# Altium project BK5811FEM.PrjPcb
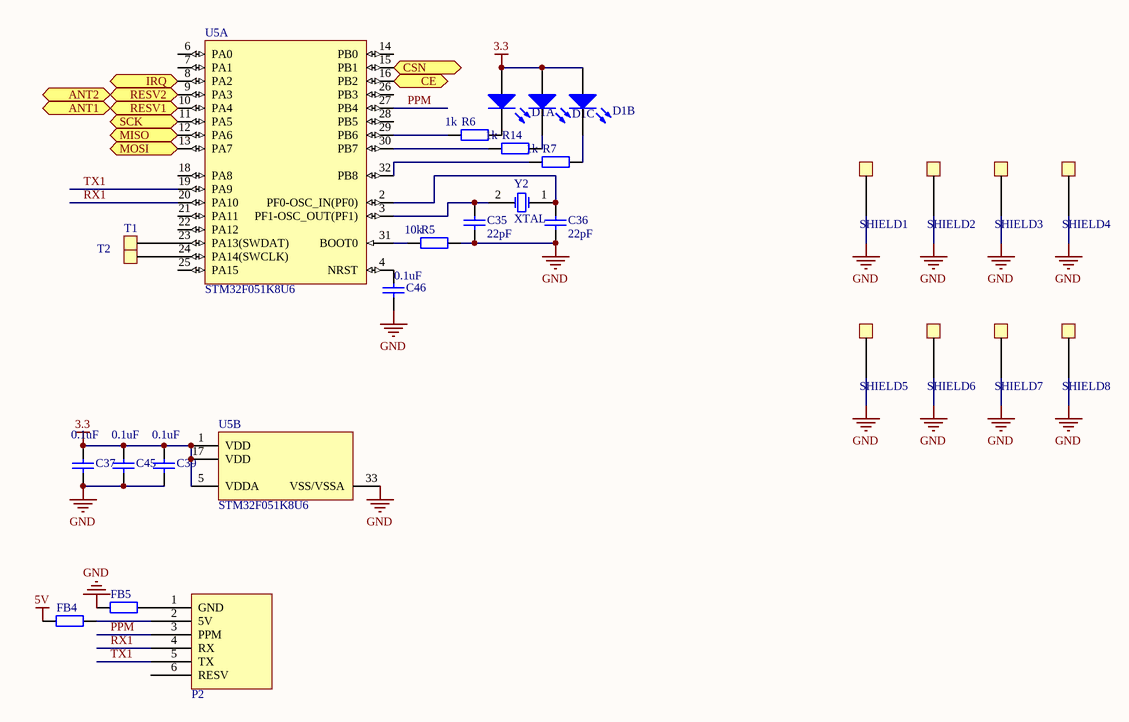
[diagram p0: MCU.SchDoc]
3 sheets, 97 parts. Net scope: flat (ports and power ports of the same name join across sheets).
Board file: 5811FEM.PcbDoc
Sheets:
  MCU.SchDoc
  BK5811.SchDoc
  FEM.SchDoc

## Sheet MCU.SchDoc
size A4

### Parts
C35  22pF  [0402]
C36  22pF  [0402]
C37  0.1uF  [0402]
C39  0.1uF  [0402]
C45  0.1uF  [0402]
C46  0.1uF  [0402]
D1  LEDx3  [LC-0603_Rx2]  (value not drawn)  (parts A,B,C of 3)
FB4  Res2  [0402]  (value not drawn)
FB5  Res2  [0402]  (value not drawn)
P2  PPMInf  [PPMInf]  (value not drawn)
R5  10k  [0402]
R6  1k  [0402]
R7  1k  [0402]
R14  1k  [0402]
SHIELD1  D  [ShieldHolder_6.5*0.8]  (value not drawn)
SHIELD2  D  [ShieldHolder_6.5*0.8]  (value not drawn)
SHIELD3  D  [ShieldHolder_6.5*0.8]  (value not drawn)
SHIELD4  D  [ShieldHolder_6.5*0.8]  (value not drawn)
SHIELD5  D  [ShieldHolder_6.5*0.8]  (value not drawn)
SHIELD6  D  [ShieldHolder_6.5*0.8]  (value not drawn)
SHIELD7  D  [ShieldHolder_6.5*0.8]  (value not drawn)
SHIELD8  D  [ShieldHolder_6.5*0.8]  (value not drawn)
T1  D  [TestPad - 1mm]  (value not drawn)
T2  TestPad  [TestPad - 1mm]  (value not drawn)
U5  STM32F051K8U6  [STM-UFQFPN32_NX]  (parts A,B of 2)
Y2  XTAL  [OSCILLATOR-3.2X2.5 - 2P]

### Ports
ANT1, ANT2, CE, CSN, IRQ, MISO, MOSI, RESV1, RESV2, SCK

### Nets
3.3: C37.1 C39.1 C45.1 D1.2(A) U5.1(VDD) U5.5(VDDA) U5.17(VDD)
5V: FB4.1
GND: C35.2 C36.1 C37.2 C39.2 C45.2 C46.2 FB5.1 R5.2 SHIELD1.1 SHIELD2.1 SHIELD3.1 SHIELD4.1 SHIELD5.1 SHIELD6.1 SHIELD7.1 SHIELD8.1 U5.33(VSS/VSSA)
CE: U5.16(PB2) ; port CE
CSN: U5.15(PB1) ; port CSN
IRQ: U5.8(PA2) ; port IRQ
MISO: U5.12(PA6) ; port MISO
MOSI: U5.13(PA7) ; port MOSI
PPM: P2.3(PPM) U5.27(PB4)
RX1: P2.4(RX) U5.20(PA10)
SCK: U5.11(PA5) ; port SCK
TX1: P2.5(TX) U5.19(PA9)
NetC35_1: C35.1 U5.3(PF1-OSC_OUT(PF1)) Y2.2(OSC2)
NetC36_2: C36.2 U5.2(PF0-OSC_IN(PF0)) Y2.1(OSC1)
NetC38_2: U5.9(PA3) ; port RESV2, port ANT2
NetC44_2: U5.10(PA4) ; port RESV1, port ANT1
NetC46_1: C46.1 U5.4(NRST)
NetD1_1: D1.1(K) R6.2
NetD1_3: D1.3(K) R7.2
NetD1_4: D1.4(K) R14.2
NetFB4_2: FB4.2 P2.2(5V)
NetFB5_2: FB5.2 P2.1(GND)
NetR5_1: R5.1 U5.31(BOOT0)
NetR6_1: R6.1 U5.29(PB6)
NetR7_1: R7.1 U5.32(PB8)
NetR14_1: R14.1 U5.30(PB7)
NetT1_1: T1.1 U5.23(PA13(SWDAT))
NetT2_1: T2.1 U5.24(PA14(SWCLK))

Not connected (* = marked no-connect by the designer): P2 6(RESV); U5 6(PA0) 7(PA1) 14(PB0) 18(PA8) 21(PA11) 22(PA12) 25(PA15) 26(PB3) 28(PB5)

### Library data of the parts
C35-C37 C39 C45 C46 = Cap: Capacitor; Published: 8-Jun-2000; LatestRevisionDate: 17-Jul-2002; LatestRevisionNote: Re-released for DXP Platform.; PackageReference: RAD-0.3; Publisher: Altium Limited; PackageDescription: Radial Cap, Thru-Hole; 2 Leads; 0.3 in Pin Spacing
D1 = LEDx3: Typical RED GaAs LED; Published: 8-Jun-2000; LatestRevisionDate: 08-Jul-2005; LatestRevisionNote: Mech Layer 1 removed.; PackageReference: LED-1; Publisher: Altium Limited; PackageDescription: LED; 2 Leads
FB4 FB5 = Res2: Resistor; Value: FB; Published: 8-Jun-2000; LatestRevisionDate: 17-Jul-2002; LatestRevisionNote: Re-released for DXP Platform.; PackageReference: AXIAL-0.4; Publisher: Altium Limited; PackageDescription: Axial Device, Thru-Hole; 2 Leads; 0.4 in Pin Spacing
R5-R7 R14 = Res2: Resistor; Value: 22k 1%; Published: 8-Jun-2000; LatestRevisionDate: 17-Jul-2002; LatestRevisionNote: Re-released for DXP Platform.; PackageReference: AXIAL-0.4; Publisher: Altium Limited; PackageDescription: Axial Device, Thru-Hole; 2 Leads; 0.4 in Pin Spacing
SHIELD1-SHIELD8 T1 = TestPad
U5 = STM32F051K8U6: ARM Cortex-M0 32-bit MCU, 64 KB Flash, 8 KB Internal RAM, 27 I/Os, 32-pin UFQFPN, -40 to 85 degC, Tray; FLASH Size (Prog) (kB): 64; I/Os (High Current): 27; Internal RAM Size (kB): 8; Operating Frequency(F) (Processor speed) (MHz): 48; Supply Voltage(Vcc) min (V): 2; DatasheetVersion: Rev. 3; PackageVersion: Rev. 3, 07/2012; PackageReference: UFQFPN32; PackageDescription: 32-Pin Ultra Thin Fine Pitch Quad Flat No-Lead, 5 x 5 x 0.6 mm Body, 0.5 mm Pitch, Exposed Pad; Supplier 1: Digi-Key; Supplier Part Number 1: 497-12892-ND; Supplier 2: Farnell; Supplier Part Number 2: 2115068; Supplier 3: Newark; Supplier Part Number 3: 05W5805; Supplier 4: Newark; Supplier Part Number 4: 90T0637; Supplier 5: Mouser; Supplier Part Number 5: 511-STM32F051K8U6; Core: ARM Cortex-M0; Packing: Tray; Mounting Technology: Surface Mount; PartNumber: STM32F051K8U6; ComponentLink1Description: Manufacturer URL; ComponentLink1URL: http://www.st.com/web/en/home.html; ComponentLink2Description: Datasheet; ComponentLink2URL: http://www.st.com/st-web-ui/static/active/en/resource/technical/document/datasheet/DM00039193.pdf; ComponentLink3Description: Package Specification; ComponentLink3URL: http://www.st.com/st-web-ui/static/active/en/resource/technical/document/datasheet/DM00039193.pdf
Y2 = XTAL: Crystal Oscillator; Published: 8-Jun-2000; LatestRevisionDate: 17-Jul-2002; LatestRevisionNote: Re-released for DXP Platform.; PackageReference: R38; Publisher: Altium Limited; PackageDescription: Crystal, Thru-Hole; 2 Leads; Body 3.1 x 8.2 mm (Dia.xH)

## Sheet BK5811.SchDoc
size A4
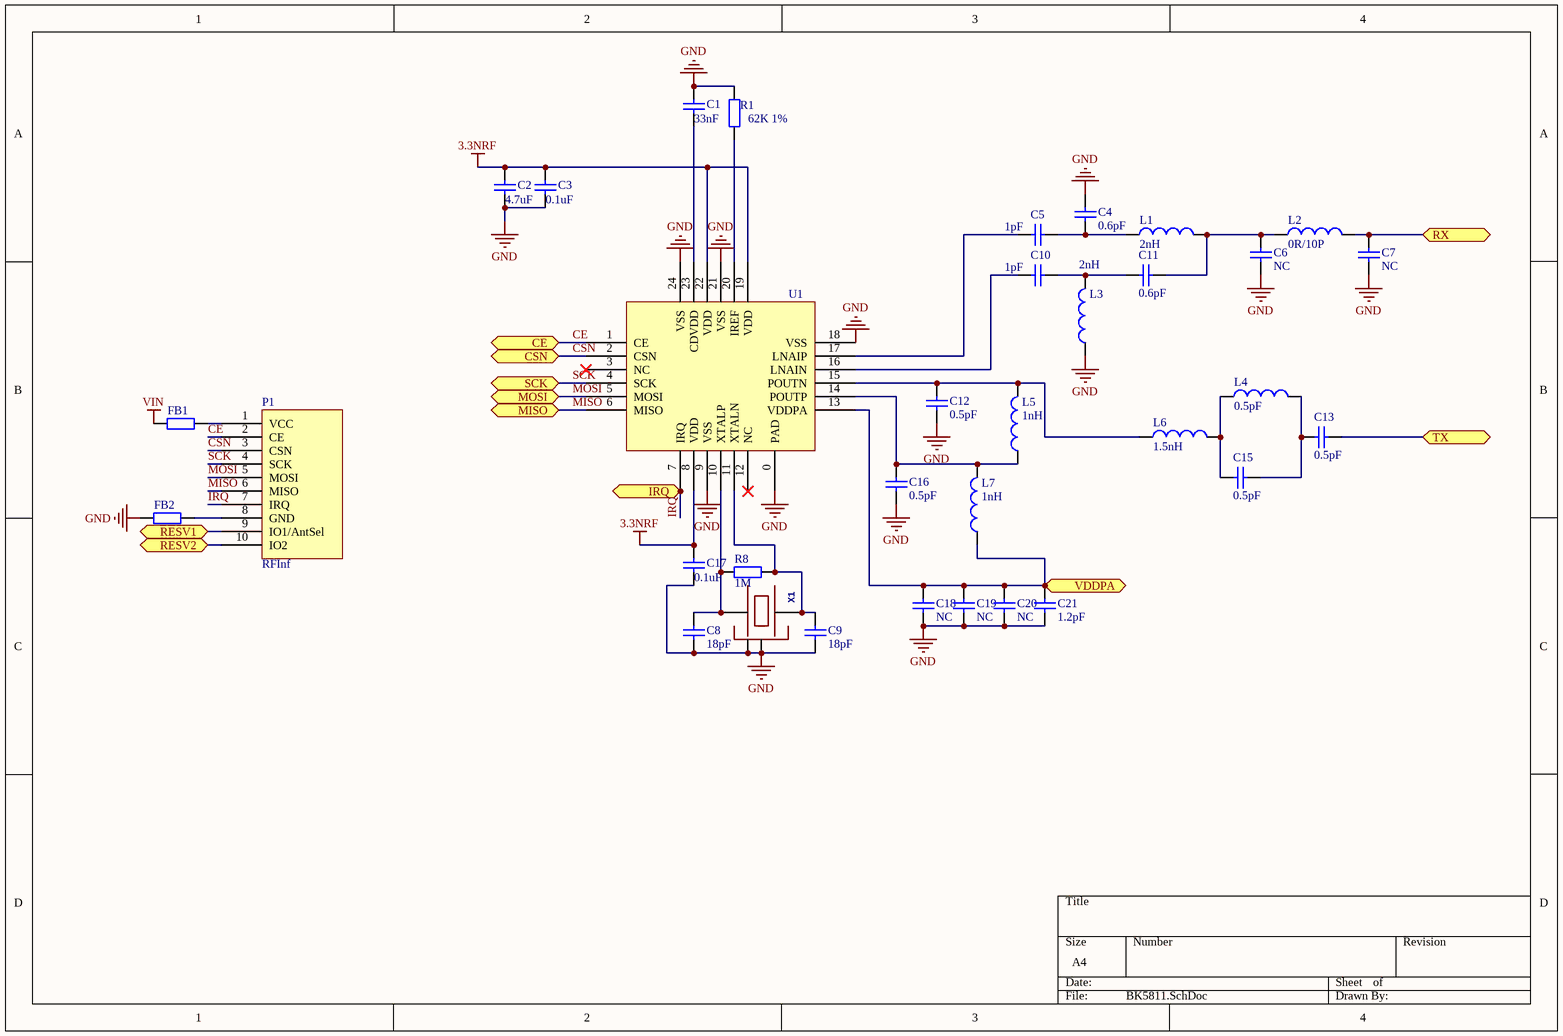
[diagram p1: BK5811.SchDoc]

### Parts
C1  33nF  [0402]
C2  4.7uF  [0603]
C3  0.1uF  [0402]
C4  0.6pF  [0402]
C5  1pF  [0402]
C6  NC  [0402]
C7  NC  [0402]
C8  value 18pF  [0402]  (hidden comment: Cap)
C9  value 18pF  [0402]  (hidden comment: Cap)
C10  1pF  [0402]
C11  0.6pF  [0402]
C12  0.5pF  [0402]
C13  0.5pF  [0402]
C15  0.5pF  [0402]
C16  0.5pF  [0402]
C17  0.1uF  [0402]
C18  NC  [0402]
C19  NC  [0402]
C20  NC  [0402]
C21  1.2pF  [0402]
FB1  Res2  [0402]  (value not drawn)
FB2  Res2  [0402]  (value not drawn)
L1  2nH  [0402]
L2  0R/10P  [0402]
L3  2nH  [0402]
L4  0.5pF  [0402]
L5  1nH  [0402]
L6  1.5nH  [0402]
L7  1nH  [0402]
P1  RFInf  [RFInf - SINGLESIDE]
R1  62K 1%  [0402]
R8  value 1M  [0402]  (hidden comment: Res2)
U1  BK5811  [BK5811]  (value not drawn)
X1  16Mhz  [OSCILLATOR-3.2X2.5]  (value not drawn)

### Ports
CE, CSN, IRQ, MISO, MOSI, RESV1, RESV2, RX, SCK, TX, VDDPA

### Nets
3.3NRF: C2.2 C3.2 C17.2 U1.8(VDD) U1.19(VDD) U1.22(VDD)
GND: C1.2 C2.1 C3.1 C4.2 C6.1 C7.1 C8.2 C9.2 C12.1 C16.1 C17.1 C18.2 C19.2 C20.2 C21.2 FB2.1 L3.1 R1.2 U1.0(PAD) U1.9(VSS) U1.18(VSS) U1.21(VSS) U1.24(VSS) X1.2(NC_2) X1.4(NC_4)
VIN: FB1.1  [project net 5V]
CE: P1.2(CE) U1.1(CE) ; port CE
CSN: P1.3(CSN) U1.2(CSN) ; port CSN
IRQ: P1.7(IRQ) U1.7(IRQ) ; port IRQ
MISO: P1.6(MISO) U1.6(MISO) ; port MISO
MOSI: P1.5(MOSI) U1.5(MOSI) ; port MOSI
SCK: P1.4(SCK) U1.4(SCK) ; port SCK
NetC1_1: C1.1 U1.23(CDVDD)
NetC4_1: C4.1 C5.2 L1.1
NetC5_1: C5.1 U1.17(LNAIP)
NetC6_2: C6.2 C11.1 L1.2 L2.1
NetC7_2: C7.2 L2.2 ; port RX
NetC8_1: C8.1 R8.2 U1.10(XTALP) X1.1
NetC9_1: C9.1 R8.1 U1.11(XTALN) X1.3
NetC10_1: C10.1 U1.16(LNAIN)
NetC10_2: C10.2 C11.2 L3.2
NetC12_2: C12.2 L5.2 L6.1 U1.15(POUTN)
NetC13_1: C13.1 C15.2 L4.2
NetC13_2: C13.2 ; port TX
NetC15_1: C15.1 L4.1 L6.2
NetC16_2: C16.2 L5.1 L7.2 U1.14(POUTP)
NetC18_1: C18.1 C19.1 C20.1 C21.1 L7.1 U1.13(VDDPA) ; port VDDPA
NetC38_2: P1.10(IO2) ; port RESV2
NetC44_2: P1.9(IO1/AntSel) ; port RESV1
NetFB1_2: FB1.2 P1.1(VCC)
NetFB2_2: FB2.2 P1.8(GND)
NetR1_1: R1.1 U1.20(IREF)

Not connected (* = marked no-connect by the designer): U1 3(NC)* 12(NC)*

### Library data of the parts
C1-C13 C15-C21 = Cap: Capacitor; Published: 8-Jun-2000; LatestRevisionDate: 17-Jul-2002; LatestRevisionNote: Re-released for DXP Platform.; PackageReference: RAD-0.3; Publisher: Altium Limited; PackageDescription: Radial Cap, Thru-Hole; 2 Leads; 0.3 in Pin Spacing
FB1 FB2 = Res2: Resistor; Value: FB; Published: 8-Jun-2000; LatestRevisionDate: 17-Jul-2002; LatestRevisionNote: Re-released for DXP Platform.; PackageReference: AXIAL-0.4; Publisher: Altium Limited; PackageDescription: Axial Device, Thru-Hole; 2 Leads; 0.4 in Pin Spacing
L1-L7 = Inductor: Code_IEC: 1005; Published: 8-Jun-2000; LatestRevisionDate: 29-May-2009; LatestRevisionNote: IPC-7351 Footprint Added.; PackageReference: 0402-A; Publisher: Altium Limited; PackageDescription: Chip Inductor; Code_JEITA: 0402
R1 R8 = Res2: Resistor; Published: 8-Jun-2000; LatestRevisionDate: 17-Jul-2002; LatestRevisionNote: Re-released for DXP Platform.; PackageReference: AXIAL-0.4; Publisher: Altium Limited; PackageDescription: Axial Device, Thru-Hole; 2 Leads; 0.4 in Pin Spacing
X1 = OSCILLATOR-3.2X2.5: Crystal Oscillator in 3.2x2.5 SMD

## Sheet FEM.SchDoc
size A4
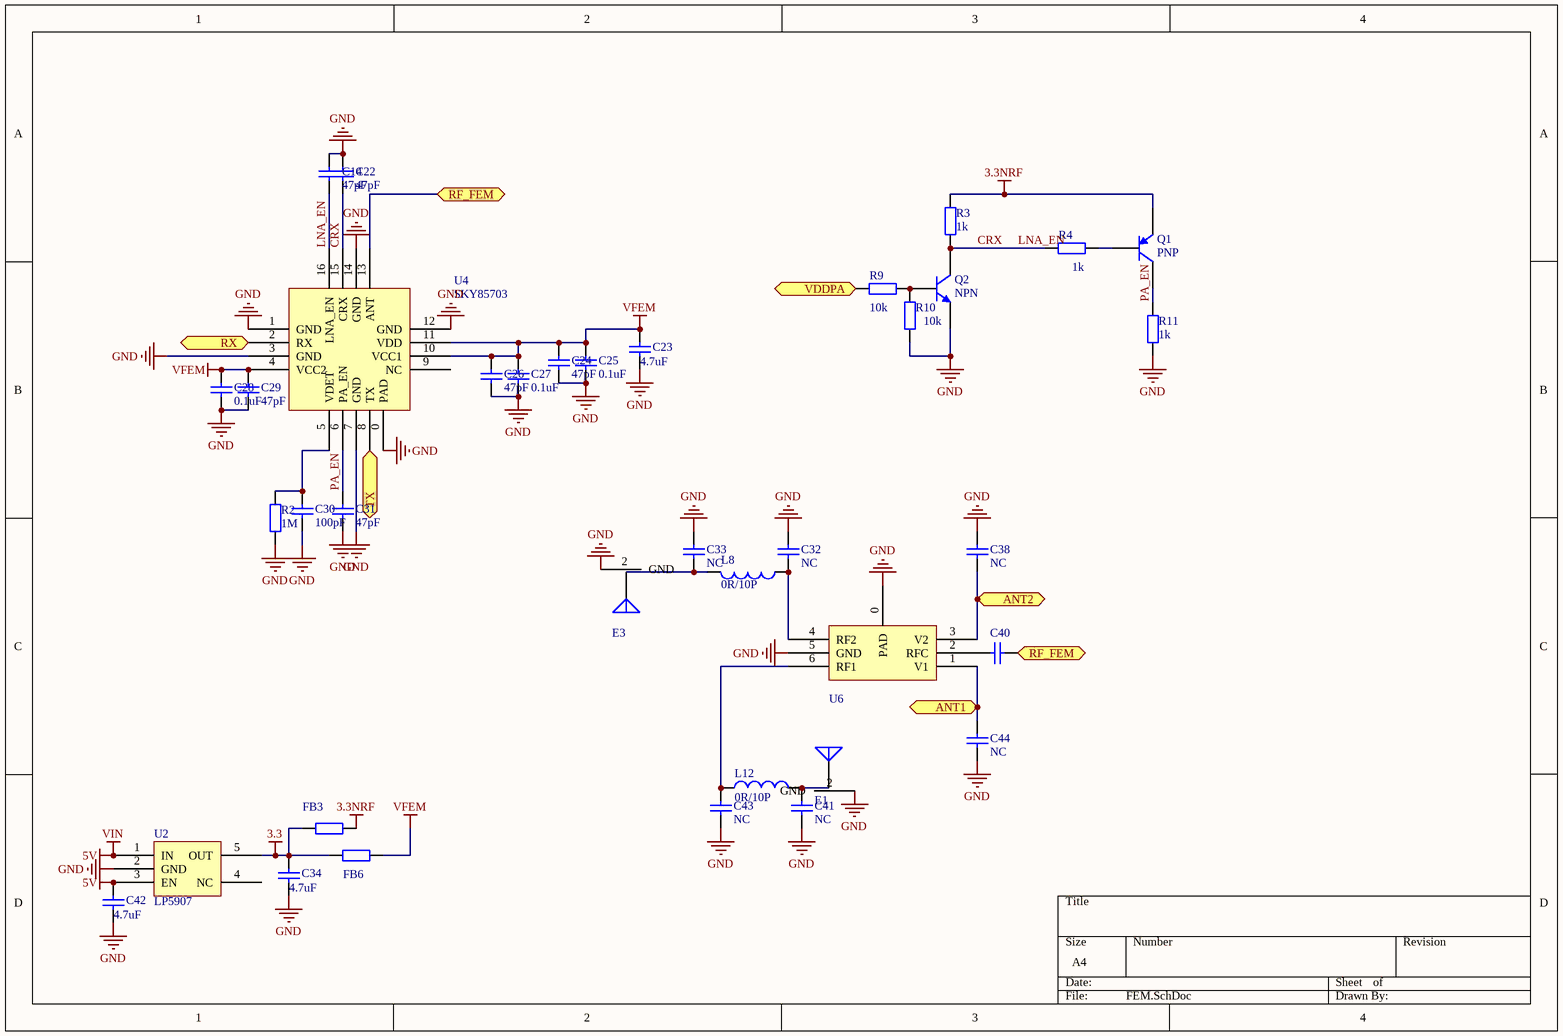
[diagram p2: FEM.SchDoc]

### Parts
C14  47pF  [0402]
C22  47pF  [0402]
C23  4.7uF  [0805]
C24  47pF  [0402]
C25  0.1uF  [0402]
C26  47pF  [0402]
C27  0.1uF  [0402]
C28  0.1uF  [0402]
C29  47pF  [0402]
C30  100pF  [0402]
C31  47pF  [0402]
C32  NC  [0402]
C33  NC  [0402]
C34  4.7uF  [0603]
C38  value NC  [0402]  (hidden comment: Cap)
C40  10p  [0402]  (value not drawn)
C41  value NC  [0402]  (hidden comment: Cap)
C42  4.7uF  [0603]
C43  value NC  [0402]  (hidden comment: Cap)
C44  value NC  [0402]  (hidden comment: Cap)
E1  Antenna  [IPEX]  (value not drawn)
E3  Antenna  [IPEX]  (value not drawn)
FB3  Res2  [0402]  (value not drawn)
FB6  Res2  [0402]  (value not drawn)
L8  0R/10P  [0402]
L12  value 0R/10P  [0402]  (hidden comment: Inductor)
Q1  PNP  [LC-SOT-323(SC-70)]
Q2  NPN  [LC-SOT-323(SC-70)]
R2  value 1M  [0402]  (hidden comment: Res2)
R3  value 1k  [0402]  (hidden comment: Res2)
R4  value 1k  [0402]  (hidden comment: Res2)
R9  10k  [0402]
R10  10k  [0402]
R11  value 1k  [0402]  (hidden comment: Res2)
U2  LP5907  [SOT23-5]
U4  SKY85703  [QFN16-3x3]
U6  SKY13370-374LF  [SKY65404-31]  (value not drawn)

### Ports
ANT1, ANT2, RF_FEM, RX, TX, VDDPA

### Nets
3.3: C34.2 FB3.1 FB6.1 U2.5(OUT)
3.3NRF: FB3.2 Q1.2(E) R3.1
5V: C42.2 U2.1(IN) U2.3(EN)  [also labelled VIN]
GND: C14.2 C22.1 C23.1 C24.1 C25.1 C26.1 C27.1 C28.1 C29.1 C30.1 C31.1 C32.1 C33.1 C34.1 C38.1 C41.2 C42.1 C43.2 C44.1 E1.2(GND) E3.2(GND) Q2.2(E) R2.2 R10.1 R11.1 U2.2(GND) U4.0(PAD) U4.1(GND) U4.3(GND) U4.7(GND) U4.12(GND) U4.14(GND) U6.0(PAD) U6.5(GND)
VFEM: C23.2 C24.2 C25.2 C26.2 C27.2 C28.2 C29.2 FB6.2 U4.4(VCC2) U4.10(VCC1) U4.11(VDD)
CRX: C14.1 C22.2 Q2.3(C) R3.2 R4.1 U4.15(CRX) U4.16(LNA_EN)  [also labelled LNA_EN]
PA_EN: C31.2 Q1.3(C) R11.2 U4.6(PA_EN)
NetC7_2: U4.2(RX) ; port RX
NetC13_2: U4.8(TX) ; port TX
NetC18_1: R9.1 ; port VDDPA
NetC30_2: C30.2 R2.1 U4.5(VDET)
NetC32_2: C32.2 L8.1 U6.4(RF2)
NetC33_2: C33.2 E3.1(ANT) L8.2
NetC38_2: C38.2 U6.3(V2) ; port ANT2
NetC40_1: C40.1 U6.2(RFC)
NetC40_2: C40.2 U4.13(ANT) ; port RF_FEM
NetC41_1: C41.1 E1.1(ANT) L12.2
NetC43_1: C43.1 L12.1 U6.6(RF1)
NetC44_2: C44.2 U6.1(V1) ; port ANT1
NetQ1_1: Q1.1(B) R4.2
NetQ2_1: Q2.1(B) R9.2 R10.2

Not connected (* = marked no-connect by the designer): U2 4(NC); U4 9(NC)

### Library data of the parts
C14 C22-C34 C38 C41-C44 = Cap: Capacitor; Published: 8-Jun-2000; LatestRevisionDate: 17-Jul-2002; LatestRevisionNote: Re-released for DXP Platform.; PackageReference: RAD-0.3; Publisher: Altium Limited; PackageDescription: Radial Cap, Thru-Hole; 2 Leads; 0.3 in Pin Spacing
C40 = Cap: Capacitor; Value: NC; Published: 8-Jun-2000; LatestRevisionDate: 17-Jul-2002; LatestRevisionNote: Re-released for DXP Platform.; PackageReference: RAD-0.3; Publisher: Altium Limited; PackageDescription: Radial Cap, Thru-Hole; 2 Leads; 0.3 in Pin Spacing
E1 E3 = Antenna: Generic Antenna; Published: 24-Mar-1999; LatestRevisionDate: 17-Jul-2002; LatestRevisionNote: Re-released for DXP Platform.; PackageReference: PIN1; Publisher: Altium Limited
FB3 FB6 = Res2: Resistor; Value: FB; Published: 8-Jun-2000; LatestRevisionDate: 17-Jul-2002; LatestRevisionNote: Re-released for DXP Platform.; PackageReference: AXIAL-0.4; Publisher: Altium Limited; PackageDescription: Axial Device, Thru-Hole; 2 Leads; 0.4 in Pin Spacing
L8 L12 = Inductor: Code_IEC: 1005; Published: 8-Jun-2000; LatestRevisionDate: 29-May-2009; LatestRevisionNote: IPC-7351 Footprint Added.; PackageReference: 0402-A; Publisher: Altium Limited; PackageDescription: Chip Inductor; Code_JEITA: 0402
Q1 = PNP: PNP Bipolar Transistor; Published: 8-Jun-2000; LatestRevisionDate: 29-May-2009; LatestRevisionNote: IPC-7351 Footprint Added.; PackageVersion: Aug-1999; PackageReference: SOT-23B; Publisher: Altium Limited; PackageDescription: 3-Pin SOT-23 Package 0.95 mm Pitch, 2.4 mm Lead Span
Q2 = NPN: NPN Bipolar Transistor; Published: 8-Jun-2000; LatestRevisionDate: 17-Jul-2002; LatestRevisionNote: Re-released for DXP Platform.; PackageReference: TO-226-AA; Publisher: Altium Limited; PackageDescription: TO, Flat Index; 3 In-Line, Axial Leads; Body Dia. 4.8mm; Leads 0.55 x 0.51 mm (max); Code_JEDEC: TO-226-AA
R2-R4 R9-R11 = Res2: Resistor; Published: 8-Jun-2000; LatestRevisionDate: 17-Jul-2002; LatestRevisionNote: Re-released for DXP Platform.; PackageReference: AXIAL-0.4; Publisher: Altium Limited; PackageDescription: Axial Device, Thru-Hole; 2 Leads; 0.4 in Pin Spacing

## Nets that join several sheets
3.3: MCU (7 pins), FEM (C34.2 FB3.1 FB6.1 U2.5)
3.3NRF: BK5811 (6 pins), FEM (FB3.2 Q1.2 R3.1)
5V: MCU (FB4.1), BK5811 (FB1.1), FEM (C42.2 U2.1 U2.3)
GND: MCU (17 pins), BK5811 (25 pins), FEM (34 pins)
CE: MCU (U5.16), BK5811 (P1.2 U1.1)
CSN: MCU (U5.15), BK5811 (P1.3 U1.2)
IRQ: MCU (U5.8), BK5811 (P1.7 U1.7)
MISO: MCU (U5.12), BK5811 (P1.6 U1.6)
MOSI: MCU (U5.13), BK5811 (P1.5 U1.5)
NetC7_2: BK5811 (C7.2 L2.2), FEM (U4.2)
NetC13_2: BK5811 (C13.2), FEM (U4.8)
NetC18_1: BK5811 (6 pins), FEM (R9.1)
NetC38_2: MCU (U5.9), BK5811 (P1.10), FEM (C38.2 U6.3)
NetC44_2: MCU (U5.10), BK5811 (P1.9), FEM (C44.2 U6.1)
SCK: MCU (U5.11), BK5811 (P1.4 U1.4)